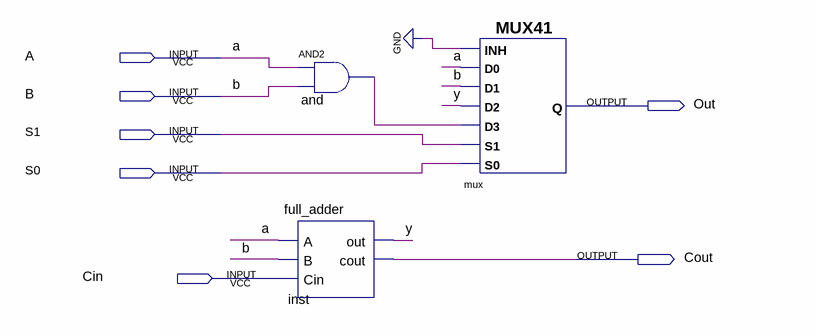
[diagram p0: schematic sheet]
// Quartus schematic one_bit_alu.bdf as structural Verilog: 3 symbols, 7 pins
module one_bit_alu (
  input  A,
  input  B,
  input  S1,
  input  S0,
  input  Cin,
  output Out,
  output Cout
);

  wire and_out, y;

  and \and  (and_out, A, B);
  full_adder inst (.A(A), .B(B), .Cin(Cin), .out(y), .cout(Cout));
  MUX41 mux (.S0(S0), .D2(y), .S1(S1), .D3(and_out), .D0(A), .INH(1'b0), .D1(B), .Q(Out));
endmodule
